# Altium project Version1.0.PrjPcb
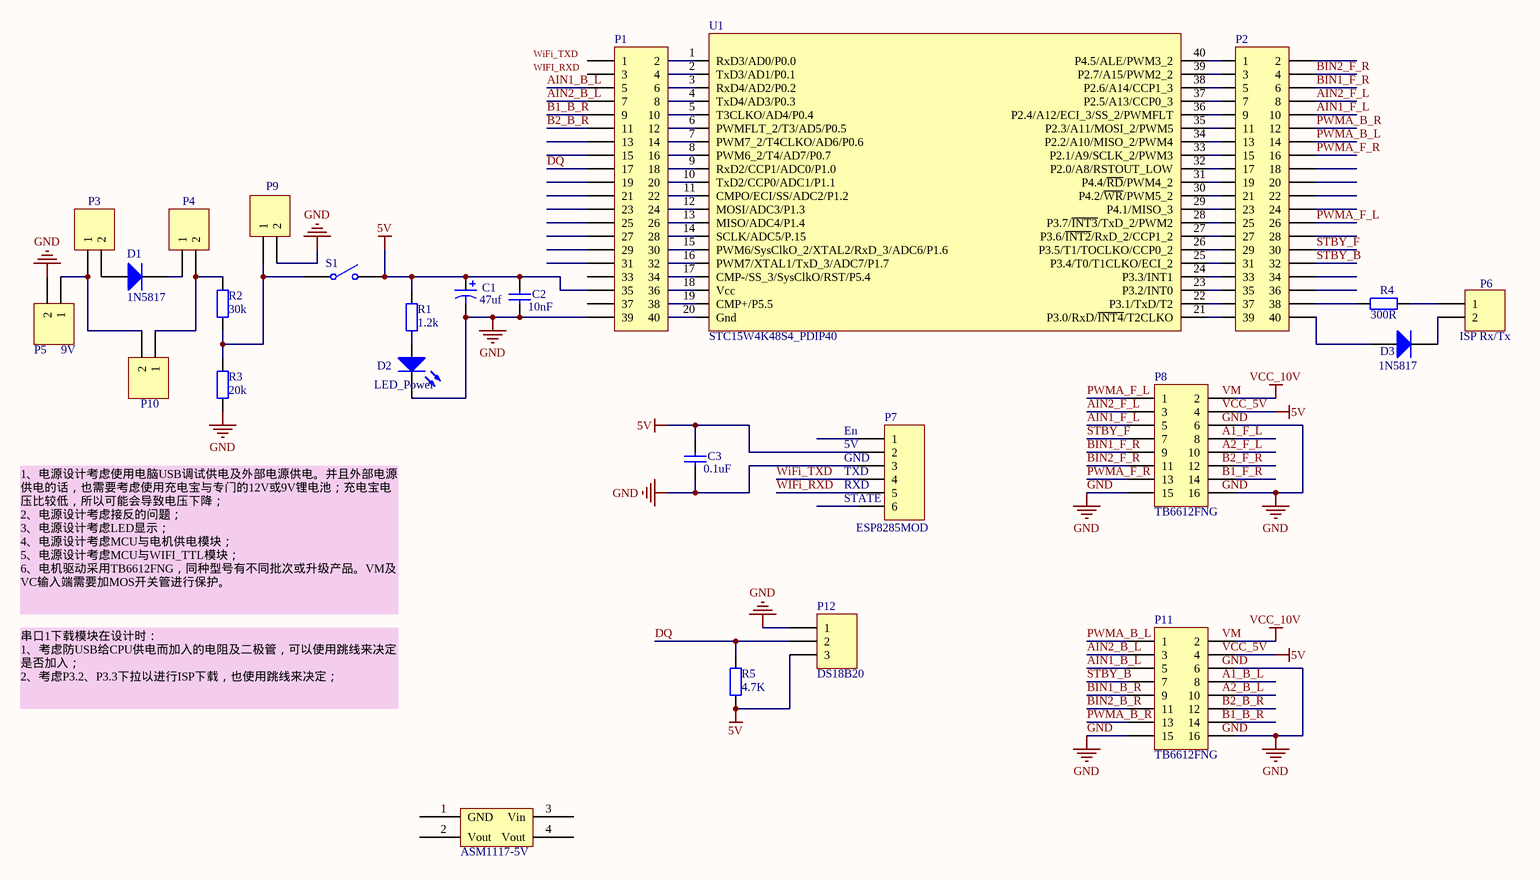
[diagram p0: Controller.SchDoc]
2 sheets, 105 parts. Net scope: global (net labels, ports and power ports of the same name join across sheets).
Sheets:
  Controller.SchDoc
  Controller2.SchDoc

## Sheet Controller.SchDoc
size A3

### Parts
(Parts that share a designator on the sheet are numbered #1, #2 ... from top to bottom, then left to right.)
ASM1117-5V#1  ASM1117-5V  [SOT-223]  (value not drawn)
C1#1  value 47uf  [RB7.6-15]  (hidden comment: Cap Pol1)
C2#1  value 10nF  [RAD-0.3]  (hidden comment: Cap)
C3#1  value 0.1uF  [RAD-0.3]  (hidden comment: Cap)
D1#1  1N5817  [DO-35]
D2#1  LED_Power  [LED-0]
D3  1N5817  [DO-35]
P1#1  Header 20X2  [HDR2X20]  (value not drawn)
P2#1  Header 20X2  [HDR2X20]  (value not drawn)
P3#1  Header 2  [HDR1X2]  (value not drawn)
P4#1  Header 2  [HDR1X2]  (value not drawn)
P5#1  9V  [HDR1X2]
P6#1  ISP Rx/Tx  [HDR1X2]
P7#1  ESP8285MOD  [HDR1X6]
P8#1  TB6612FNG  [HDR2X8]
P9  Header 2  [HDR1X2]  (value not drawn)
P10  Header 2  [HDR1X2]  (value not drawn)
P11  TB6612FNG  [HDR2X8]
P12  DS18B20  [HDR1X3]
R1  value 1.2k  [AXIAL-0.4]  (hidden comment: Res2)
R2#1  value 30k  [AXIAL-0.4]  (hidden comment: Res2)
R3#1  value 20k  [AXIAL-0.4]  (hidden comment: Res2)
R4#1  value 300R  [AXIAL-0.4]  (hidden comment: Res2)
R5#1  value 4.7K  [AXIAL-0.4]  (hidden comment: Res2)
S1#1  SW-SPST  [SPST-2]  (value not drawn)
U1  STC15W4K48S4_PDIP40  [STC15W4K48S4_DIP40]

### Nets
5V: C1#1.1 C2#1.2 C3#1.2 P1#1.35 P7#1.2 P8#1.4 P11.4 P12.3 R1.1 R5#1.2 S1#1.2(NO)
GND: C1#1.2 C2#1.1 C3#1.1 D2#1.2(K) P1#1.39 P5#1.2 P7#1.3 P8#1.6 P8#1.15 P8#1.16 P9.2 P11.6 P11.15 P11.16 P12.1 R3#1.1
VCC_10V: P8#1.2 P11.2
AIN1_B_L: P1#1.5 P11.5
AIN1_F_L: P2#1.10 P8#1.5
AIN2_B_L: P1#1.7 P11.3
AIN2_F_L: P2#1.8 P8#1.3
B1_B_R: P1#1.9
B2_B_R: P1#1.11
BIN1_B_R: P11.9
BIN1_F_R: P2#1.6 P8#1.9
BIN2_B_R: P11.11
BIN2_F_R: P2#1.4 P8#1.11
DQ: P1#1.17 P12.2 R5#1.1
PWMA_B_L: P2#1.14 P11.1
PWMA_B_R: P2#1.12 P11.13
PWMA_F_L: P2#1.26 P8#1.1
PWMA_F_R: P2#1.16 P8#1.13
STBY_B: P2#1.32 P11.7
STBY_F: P2#1.30 P8#1.7
WIFi_RXD: P7#1.5
WiFi_TXD: P7#1.4
NetD1#1_1: D1#1.1(A) P3#1.2
NetD1#1_2: D1#1.2(K) P4#1.1
NetD2#1_1: D2#1.1(A) R1.2
NetD3_1: D3.1(A) P2#1.40
NetD3_2: D3.2(K) P6#1.2
NetP1#1_2: P1#1.2 U1.1(RxD3/AD0/P0.0)
NetP1#1_4: P1#1.4 U1.2(TxD3/AD1/P0.1)
NetP1#1_6: P1#1.6 U1.3(RxD4/AD2/P0.2)
NetP1#1_8: P1#1.8 U1.4(TxD4/AD3/P0.3)
NetP1#1_10: P1#1.10 U1.5(T3CLKO/AD4/P0.4)
NetP1#1_12: P1#1.12 U1.6(PWMFLT_2/T3/AD5/P0.5)
NetP1#1_14: P1#1.14 U1.7(PWM7_2/T4CLKO/AD6/P0.6)
NetP1#1_16: P1#1.16 U1.8(PWM6_2/T4/AD7/P0.7)
NetP1#1_18: P1#1.18 U1.9(RxD2/CCP1/ADC0/P1.0)
NetP1#1_20: P1#1.20 U1.10(TxD2/CCP0/ADC1/P1.1)
NetP1#1_22: P1#1.22 U1.11(CMPO/ECI/SS/ADC2/P1.2)
NetP1#1_24: P1#1.24 U1.12(MOSI/ADC3/P1.3)
NetP1#1_26: P1#1.26 U1.13(MISO/ADC4/P1.4)
NetP1#1_28: P1#1.28 U1.14(SCLK/ADC5/P.15)
NetP1#1_30: P1#1.30 U1.15(PWM6/SysClkO_2/XTAL2/RxD_3/ADC6/P1.6)
NetP1#1_32: P1#1.32 U1.16(PWM7/XTAL1/TxD_3/ADC7/P1.7)
NetP1#1_34: P1#1.34 U1.17(CMP-/SS_3/SysClkO/RST/P5.4)
NetP1#1_36: P1#1.36 U1.18(Vcc)
NetP1#1_38: P1#1.38 U1.19(CMP+/P5.5)
NetP1#1_40: P1#1.40 U1.20(Gnd)
NetP2#1_1: P2#1.1 U1.40(P4.5/ALE/PWM3_2)
NetP2#1_3: P2#1.3 U1.39(P2.7/A15/PWM2_2)
NetP2#1_5: P2#1.5 U1.38(P2.6/A14/CCP1_3)
NetP2#1_7: P2#1.7 U1.37(P2.5/A13/CCP0_3)
NetP2#1_9: P2#1.9 U1.36(P2.4/A12/ECI_3/SS_2/PWMFLT)
NetP2#1_11: P2#1.11 U1.35(P2.3/A11/MOSI_2/PWM5)
NetP2#1_13: P2#1.13 U1.34(P2.2/A10/MISO_2/PWM4)
NetP2#1_15: P2#1.15 U1.33(P2.1/A9/SCLK_2/PWM3)
NetP2#1_17: P2#1.17 U1.32(P2.0/A8/RSTOUT_LOW)
NetP2#1_19: P2#1.19 U1.31(P4.4/~{RD}/PWM4_2)
NetP2#1_21: P2#1.21 U1.30(P4.2/~{WR}/PWM5_2)
NetP2#1_23: P2#1.23 U1.29(P4.1/MISO_3)
NetP2#1_25: P2#1.25 U1.28(P3.7/~{INT3}/TxD_2/PWM2)
NetP2#1_27: P2#1.27 U1.27(P3.6/~{INT2}/RxD_2/CCP1_2)
NetP2#1_29: P2#1.29 U1.26(P3.5/T1/TOCLKO/CCP0_2)
NetP2#1_31: P2#1.31 U1.25(P3.4/T0/T1CLKO/ECI_2)
NetP2#1_33: P2#1.33 U1.24(P3.3/INT1)
NetP2#1_35: P2#1.35 U1.23(P3.2/INT0)
NetP2#1_37: P2#1.37 U1.22(P3.1/TxD/T2)
NetP2#1_38: P2#1.38 R4#1.1
NetP2#1_39: P2#1.39 U1.21(P3.0/RxD/~{INT4}/T2CLKO)
NetP3#1_1: P3#1.1 P5#1.1 P10.2
NetP4#1_2: P4#1.2 P10.1 R2#1.2
NetP6#1_1: P6#1.1 R4#1.2
NetP9_1: P9.1 R2#1.1 R3#1.2 S1#1.1(COMMON)

Not connected (* = marked no-connect by the designer): ASM1117-5V#1 1(GND) 2(Vout) 3(Vin) 4(Vout); P1#1 1 3 13 15 19 21 23 25 27 29 31 33 37; P2#1 2 18 20 22 24 28 34 36; P7#1 1 6; P8#1 8 10 12 14; P11 8 10 12 14

### Notes on the sheet
- (near P7#1) En
- (near P7#1) 5V
- (near P7#1) GND
- (near P7#1) TXD
- (near P7#1) RXD
- (near P7#1) STATE
- 1、电源设计考虑使用电脑USB调试供电及外部电源供电。并且外部电源供电的话，也需要考虑使用充电宝与专门的12V或9V锂电池；充电宝电压比较低，所以可能会导致电压下降；
  2、电源设计考虑接反的问题；
  3、电源设计考虑LED显示；
  4、电源设计考虑MCU与电机供电模块；
  5、电源设计考虑MCU与WIFI_TTL模块；
  6、电机驱动采用TB6612FNG，同种型号有不同批次或升级产品。VM及VC输入端需要加MOS开关管进行保护。
- 串口1下载模块在设计时：
  1、考虑防USB给CPU供电而加入的电阻及二极管，可以使用跳线来决定是否加入；
  2、考虑P3.2、P3.3下拉以进行ISP下载，也使用跳线来决定；
- Labels drawn without touching a wire or pin: A1_B_L, A1_F_L, A2_B_L, A2_F_L, B1_B_R, B1_F_R, B2_B_R, B2_F_R, GND, VCC_5V, VM, WIFI_RXD, WiFi_TXD

### Library data of the parts
C1#1 = Cap Pol1: Polarized Capacitor (Radial); Published: 8-Jun-2000; LatestRevisionDate: 17-Jul-2002; LatestRevisionNote: Re-released for DXP Platform.; PackageReference: RB7.6-15; Publisher: Altium Limited; PackageDescription: Polarized Capacitor (Radial); 2 Leads
C2#1 C3#1 = Cap: Capacitor; Published: 8-Jun-2000; LatestRevisionDate: 17-Jul-2002; LatestRevisionNote: Re-released for DXP Platform.; PackageReference: RAD-0.3; Publisher: Altium Limited; PackageDescription: Radial Cap, Thru-Hole; 2 Leads; 0.3 in Pin Spacing
D1#1 D3 = Diode 1N914: High Conductance Fast Diode; Published: 8-Jun-2000; LatestRevisionDate: 17-Jul-2002; LatestRevisionNote: Re-released for DXP Platform.; DatasheetVersion: 1997; PackageReference: DO-35; Publisher: Altium Limited; PackageDescription: Diode, Axial; Body 3.8 x 1.9 mm (LxDia. max), Lead Dia. 0.53 mm (max); Code_JEDEC: DO-204-AH; ComponentLink1Description: Manufacturer Link; ComponentLink1URL: http://www.fairchildsemi.com/; ComponentLink2Description: Datasheet; ComponentLink2URL: http://www.fairchildsemi.com/ds/1N%2F1N4448.pdf
D2#1 = LED0: Typical INFRARED GaAs LED; Published: 8-Jun-2000; LatestRevisionDate: 08-Jul-2005; LatestRevisionNote: Mech Layer 1 removed.; PackageReference: LED-0; Publisher: Altium Limited; PackageDescription: LED; 2 Leads
P1#1 P2#1 = Header 20X2: Header, 20-Pin, Dual row; LatestRevisionDate: 17-Jul-2002; LatestRevisionNote: Re-released for DXP Platform.; Publisher: Altium Limited
P3#1 P4#1 P5#1 P6#1 P9 P10 = Header 2: Header, 2-Pin; LatestRevisionDate: 17-Jul-2002; LatestRevisionNote: Re-released for DXP Platform.; Publisher: Altium Limited
P7#1 = Header 6: Header, 6-Pin; LatestRevisionDate: 17-Jul-2002; LatestRevisionNote: Re-released for DXP Platform.; Publisher: Altium Limited
P8#1 P11 = Header 8X2: Header, 8-Pin, Dual row; LatestRevisionDate: 17-Jul-2002; LatestRevisionNote: Re-released for DXP Platform.; Publisher: Altium Limited
P12 = Header 3: Header, 3-Pin; LatestRevisionDate: 17-Jul-2002; LatestRevisionNote: Re-released for DXP Platform.; Publisher: Altium Limited
R1 R2#1 R3#1 R4#1 R5#1 = Res2: Resistor; Published: 8-Jun-2000; LatestRevisionDate: 17-Jul-2002; LatestRevisionNote: Re-released for DXP Platform.; PackageReference: AXIAL-0.4; Publisher: Altium Limited; PackageDescription: Axial Device, Thru-Hole; 2 Leads; 0.4 in Pin Spacing
S1#1 = SW-SPST: Single-Pole, Single-Throw Switch; Published: 24-Mar-1999; LatestRevisionDate: 17-Jul-2002; LatestRevisionNote: Re-released for DXP Platform.; PackageReference: SPST-2; Publisher: Altium Limited; PackageDescription: Switch; 2 Leads
U1 = STC15W4K48S4_PDIP40: STC15W4K48S4

## Sheet Controller2.SchDoc
size A3
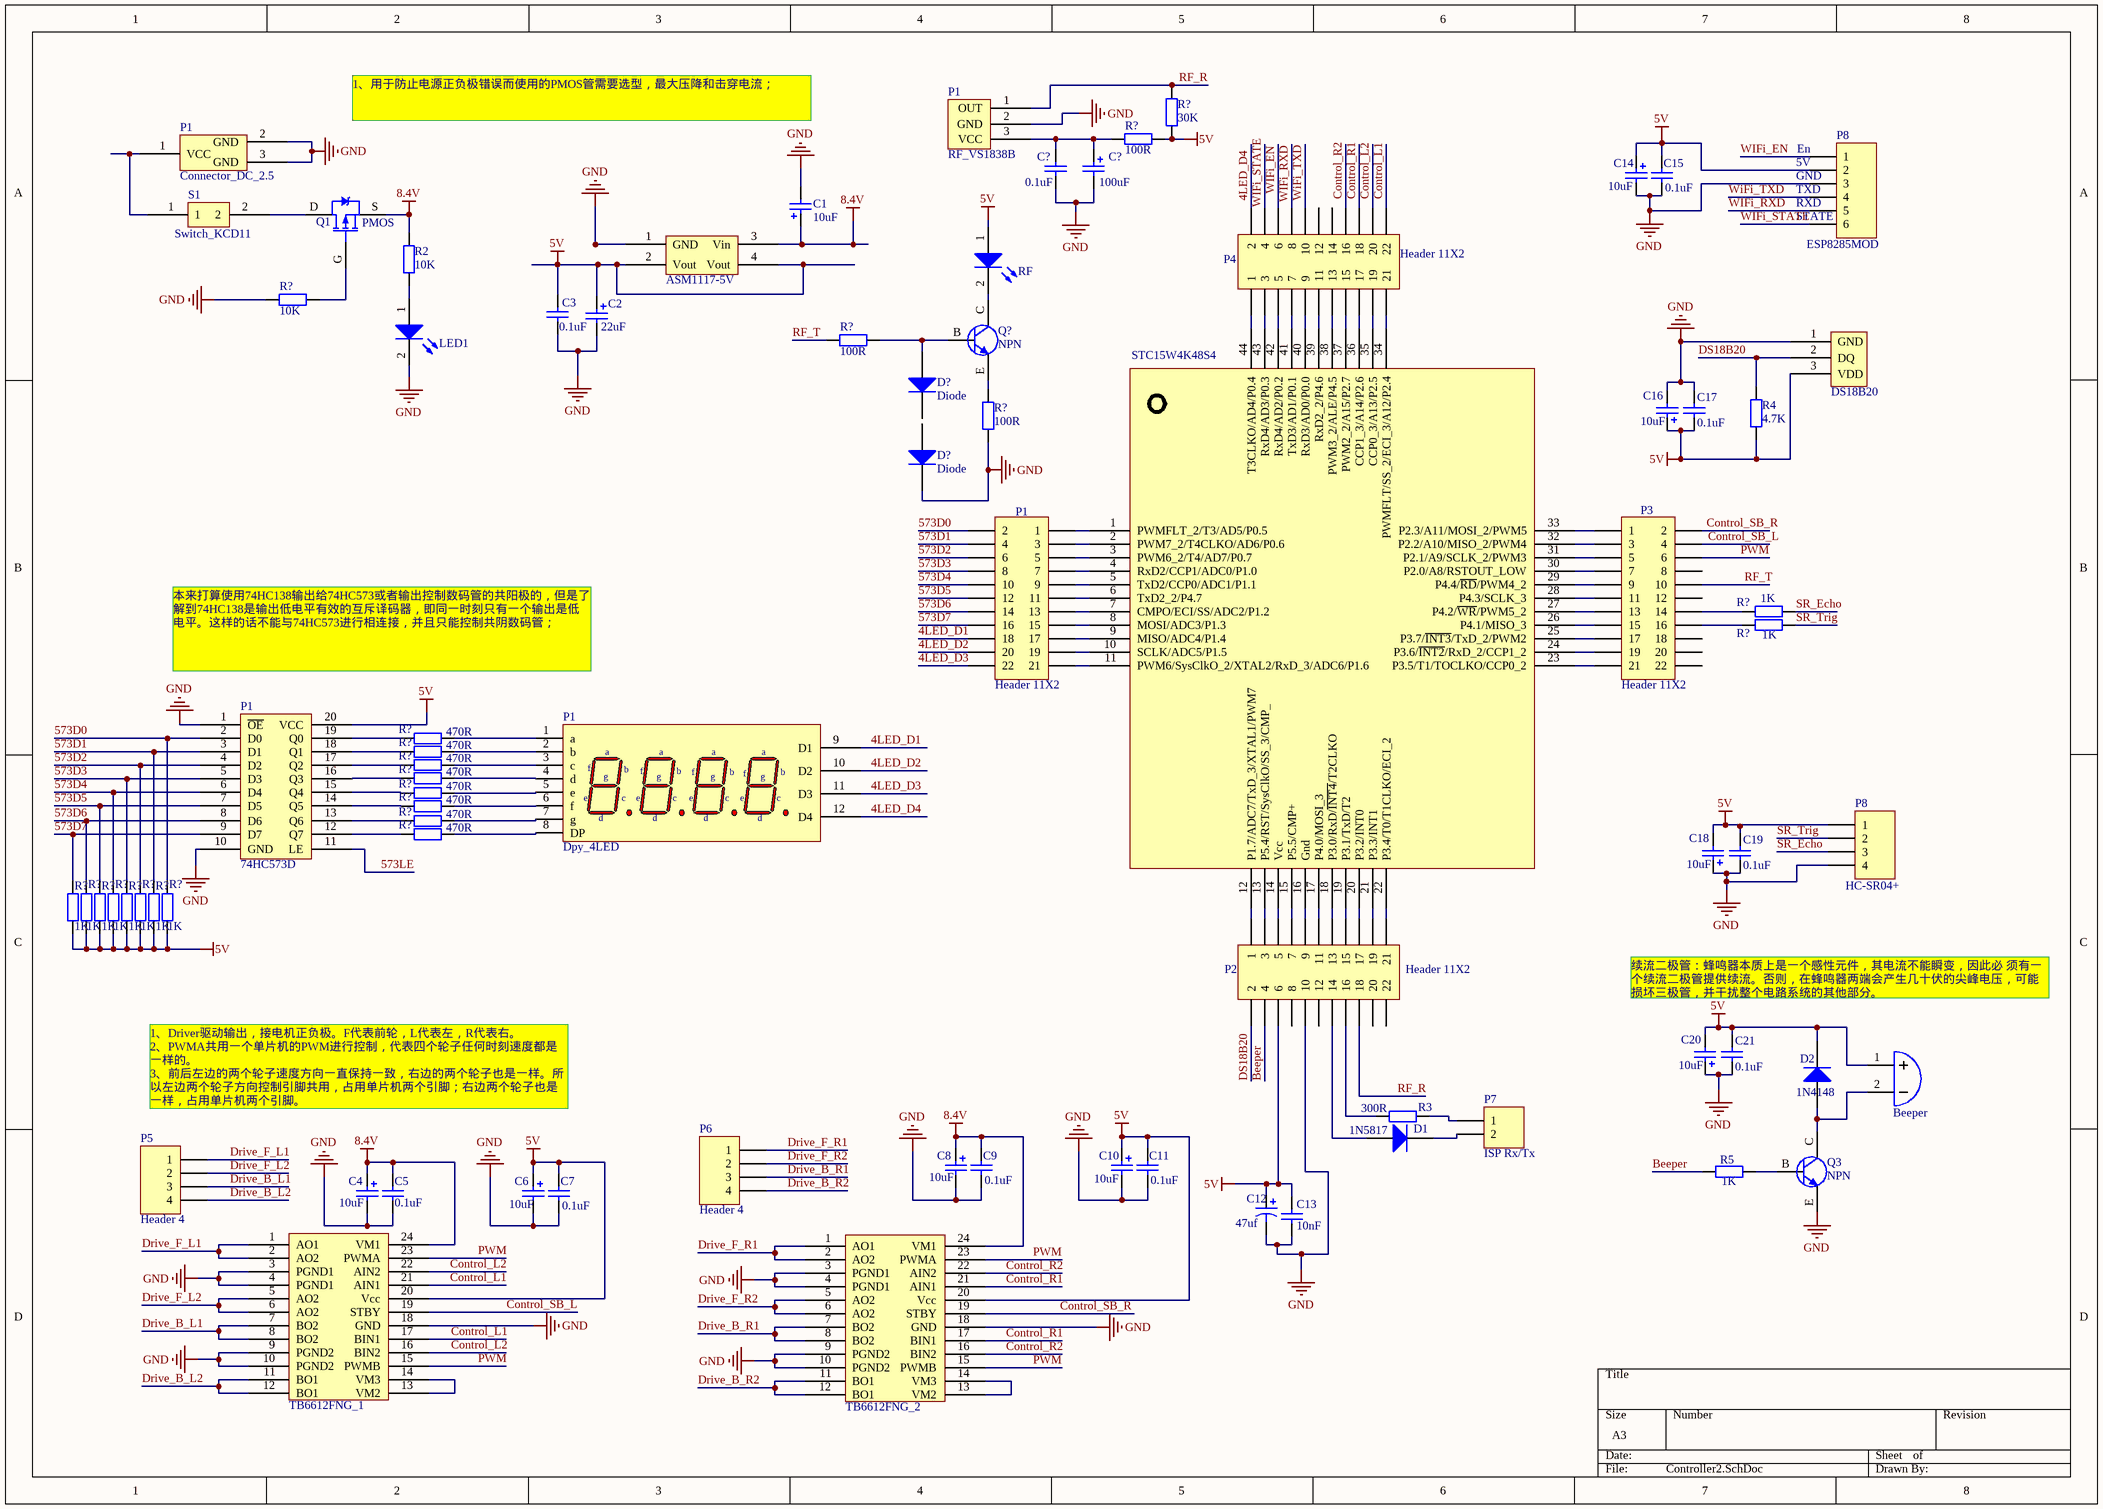
[diagram p1: Controller2.SchDoc]

### Parts
(Parts that share a designator on the sheet are numbered #1, #2 ... from top to bottom, then left to right.)
*  STC15W4K48S4  [STC15W4K48S4_LQFP44]
ASM1117-5V#2  ASM1117-5V  [SOT-223]  (value not drawn)
Beeper  Beeper  [Buzzer-2Pins]  (value not drawn)
C1#2  value 10uF  [C1206-Pole]  (hidden comment: Cap_Pole)
C2#2  value 22uF  [C1206-Pole]  (hidden comment: Cap_Pole)
C3#2  value 0.1uF  [C0603]  (hidden comment: Cap)
C4  10uF  [C1206-Pole]
C5  0.1uF  [C0603]
C6  10uF  [C1206-Pole]
C7  0.1uF  [C0603]
C8  10uF  [C1206-Pole]
C9  0.1uF  [C0603]
C10  10uF  [C1206-Pole]
C11  0.1uF  [C0603]
C12  value 47uf  [RB7.6-15]  (hidden comment: Cap Pol1)
C13  value 10nF  [RAD-0.3]  (hidden comment: Cap)
C14  10uF  [C1206-Pole]
C15  0.1uF  [C0603]
C16  10uF  [C1206-Pole]
C17  0.1uF  [C0603]
C18  10uF  [C1206-Pole]
C19  0.1uF  [C0603]
C20  10uF  [C1206-Pole]
C21  0.1uF  [C0603]
C?#1  value 0.1uF  [C0603]  (hidden comment: Cap)
C?#2  value 100uF  [C1206-Pole]  (hidden comment: Cap_Pole)
D1#2  1N5817  [DO-35]
D2#2  1N4148  [SMA/DO-214AC]
D?#1  Diode  [SMA/DO-214AC]
D?#2  Diode  [SMA/DO-214AC]
DS18B20  DS18B20  [TO-92]  (value not drawn)
LED1  LED-0805  [LED-0805]  (value not drawn)
P1#2  RF_VS1838B  [RF_VS1838B]
P1#3  Connector_DC_2.5  [Connector_DC_2.5]
P1#4  Header 11X2  [HDR2X11]
P1#5  74HC573D  [74HC573D_SOP]
P1#6  Dpy_4LED  [Dpy_LED4_Power]
P2#2  Header 11X2  [HDR2X11]
P3#2  Header 11X2  [HDR2X11]
P4#2  Header 11X2  [HDR2X11]
P5#2  Header 4  [HDR1X4]
P6#2  Header 4  [HDR1X4]
P7#2  ISP Rx/Tx  [HDR1X2]
P8#2  ESP8285MOD  [HDR1X6]
P8#3  HC-SR04+  [HDR1X4]
Q1  PMOS  [SOT-23/MOS]
Q3  NPN  [SOT-23/transistor]
Q?  NPN  [SOT-23/transistor]
R2#2  10K  [R0603]
R3#2  value 300R  [AXIAL-0.4]  (hidden comment: Res2)
R4#2  4.7K  [R0603]
R5#2  1K  [R0603]
R?#1  100R  [R0603]
R?#2  30K  [R0603]
R?#3  10K  [R0603]
R?#4  100R  [R0603]
R?#5  100R  [R0603]
R?#6  1K  [R0603]
R?#7  1K  [R0603]
R?#8  470R  [R0603]
R?#9  470R  [R0603]
R?#10  470R  [R0603]
R?#11  470R  [R0603]
R?#12  470R  [R0603]
R?#13  470R  [R0603]
R?#14  470R  [R0603]
R?#15  470R  [R0603]
R?#16  1K  [R0603]
R?#17  1K  [R0603]
R?#18  1K  [R0603]
R?#19  1K  [R0603]
R?#20  1K  [R0603]
R?#21  1K  [R0603]
R?#22  1K  [R0603]
R?#23  1K  [R0603]
RF  LED-0805  [LED-0805]  (value not drawn)
S1#2  Switch_KCD11  [Switch_KCD11]
TB6612FNG_1  TB6612FNG  [ssop24]  (value not drawn)
TB6612FNG_2  TB6612FNG  [ssop24]  (value not drawn)

### Nets
5V: ASM1117-5V#2.2(Vout) ASM1117-5V#2.4(Vout) Beeper.1(A) C2#2.1 C3#2.1 C6.1 C7.1 C10.1 C11.1 C12.1 C13.2 C16.1 C17.2 C18.2 C19.1 C20.2 C21.1 D2#2.2 DS18B20.3(VDD) P1#5.20(VCC) P2#2.6 P8#3.1 R4#2.1 R?#1.1 R?#2.2 R?#16.1 R?#17.1 R?#18.1 R?#19.1 R?#20.1 R?#21.1 R?#22.1 R?#23.1 RF.1(A) TB6612FNG_1.20(Vcc) TB6612FNG_2.20(Vcc)
8.4V: ASM1117-5V#2.3(Vin) C1#2.1 C4.1 C5.1 C8.1 C9.1 Q1.S R2#2.1 TB6612FNG_1.24(VM1) TB6612FNG_2.24(VM1)
GND: ASM1117-5V#2.1(GND) C1#2.2 C2#2.2 C3#2.2 C4.2 C5.2 C6.2 C7.2 C8.2 C9.2 C10.2 C11.2 C12.2 C13.1 C14.2 C15.2 C16.2 C17.1 C18.1 C19.2 C20.1 C21.2 C?#1.2 C?#2.2 D?#2.2 DS18B20.1(GND) LED1.2(K) P1#2.2(GND) P1#3.2(GND) P1#3.3(GND) P1#5.1(~{OE}) P1#5.10(GND) P2#2.10 P8#2.3 P8#3.4 Q3.E R?#3.1 R?#5.2 TB6612FNG_1.3(PGND1) TB6612FNG_1.4(PGND1) TB6612FNG_1.9(PGND2) TB6612FNG_1.10(PGND2) TB6612FNG_1.18(GND) TB6612FNG_2.3(PGND1) TB6612FNG_2.4(PGND1) TB6612FNG_2.9(PGND2) TB6612FNG_2.10(PGND2) TB6612FNG_2.18(GND)
4LED_D1: P1#4.18 P1#6.9(D1)
4LED_D2: P1#4.20 P1#6.10(D2)
4LED_D3: P1#4.22 P1#6.11(D3)
4LED_D4: P1#6.12(D4) P4#2.2
573D0: P1#4.2 P1#5.2(D0) R?#23.2
573D1: P1#4.4 P1#5.3(D1) R?#22.2
573D2: P1#4.6 P1#5.4(D2) R?#21.2
573D3: P1#4.8 P1#5.5(D3) R?#20.2
573D4: P1#4.10 P1#5.6(D4) R?#19.2
573D5: P1#4.12 P1#5.7(D5) R?#18.2
573D6: P1#4.14 P1#5.8(D6) R?#17.2
573D7: P1#4.16 P1#5.9(D7) R?#16.2
573LE: P1#5.11(LE)
Beeper: P2#2.4 R5#2.1
Control_L1: P4#2.22 TB6612FNG_1.17(BIN1) TB6612FNG_1.21(AIN1)
Control_L2: P4#2.20 TB6612FNG_1.16(BIN2) TB6612FNG_1.22(AIN2)
Control_R1: P4#2.18 TB6612FNG_2.17(BIN1) TB6612FNG_2.21(AIN1)
Control_R2: P4#2.16 TB6612FNG_2.16(BIN2) TB6612FNG_2.22(AIN2)
Control_SB_L: P3#2.4 TB6612FNG_1.19(STBY)
Control_SB_R: P3#2.2 TB6612FNG_2.19(STBY)
Drive_B_L1: P5#2.3 TB6612FNG_1.7(BO2) TB6612FNG_1.8(BO2)
Drive_B_L2: P5#2.4 TB6612FNG_1.11(BO1) TB6612FNG_1.12(BO1)
Drive_B_R1: P6#2.3 TB6612FNG_2.7(BO2) TB6612FNG_2.8(BO2)
Drive_B_R2: P6#2.4 TB6612FNG_2.11(BO1) TB6612FNG_2.12(BO1)
Drive_F_L1: P5#2.1 TB6612FNG_1.1(AO1) TB6612FNG_1.2(AO2)
Drive_F_L2: P5#2.2 TB6612FNG_1.5(AO2) TB6612FNG_1.6(AO2)
Drive_F_R1: P6#2.1 TB6612FNG_2.1(AO1) TB6612FNG_2.2(AO2)
Drive_F_R2: P6#2.2 TB6612FNG_2.5(AO2) TB6612FNG_2.6(AO2)
DS18B20: DS18B20.2(DQ) P2#2.2 R4#2.2
PWM: P3#2.6 TB6612FNG_1.15(PWMB) TB6612FNG_1.23(PWMA) TB6612FNG_2.15(PWMB) TB6612FNG_2.23(PWMA)
RF_R: P1#2.1(OUT) P2#2.18 R?#2.1
RF_T: P3#2.10 R?#4.2
SR_Echo: P8#3.3 R?#6.2
SR_Trig: P8#3.2 R?#7.2
WIFi_EN: P4#2.6 P8#2.1
WIFi_RXD: P4#2.8 P8#2.5
WIFi_STATE: P4#2.4 P8#2.6
WiFi_TXD: P4#2.10 P8#2.4
Net*_1: *.1(PWMFLT_2/T3/AD5/P0.5) P1#4.1
Net*_2: *.2(PWM7_2/T4CLKO/AD6/P0.6) P1#4.3
Net*_3: *.3(PWM6_2/T4/AD7/P0.7) P1#4.5
Net*_4: *.4(RxD2/CCP1/ADC0/P1.0) P1#4.7
Net*_5: *.5(TxD2/CCP0/ADC1/P1.1) P1#4.9
Net*_6: *.6(TxD2_2/P4.7) P1#4.11
Net*_7: *.7(CMPO/ECI/SS/ADC2/P1.2) P1#4.13
Net*_8: *.8(MOSI/ADC3/P1.3) P1#4.15
Net*_9: *.9(MISO/ADC4/P1.4) P1#4.17
Net*_10: *.10(SCLK/ADC5/P1.5) P1#4.19
Net*_11: *.11(PWM6/SysClkO_2/XTAL2/RxD_3/ADC6/P1.6) P1#4.21
Net*_12: *.12(P1.7/ADC7/TxD_3/XTAL1/PWM7) P2#2.1
Net*_13: *.13(P5.4/RST/SysClkO/SS_3/CMP_) P2#2.3
Net*_14: *.14(Vcc) P2#2.5
Net*_15: *.15(P5.5/CMP+) P2#2.7
Net*_16: *.16(Gnd) P2#2.9
Net*_17: *.17(P4.0/MOSI_3) P2#2.11
Net*_18: *.18(P3.0/RxD/~{INT4}/T2CLKO) P2#2.13
Net*_19: *.19(P3.1/TxD/T2) P2#2.15
Net*_20: *.20(P3.2/INT0) P2#2.17
Net*_21: *.21(P3.3/INT1) P2#2.19
Net*_22: *.22(P3.4/T0/T1CLKO/ECI_2) P2#2.21
Net*_23: *.23(P3.5/T1/TOCLKO/CCP0_2) P3#2.21
Net*_24: *.24(P3.6/~{INT2}/RxD_2/CCP1_2) P3#2.19
Net*_25: *.25(P3.7/~{INT3}/TxD_2/PWM2) P3#2.17
Net*_26: *.26(P4.1/MISO_3) P3#2.15
Net*_27: *.27(P4.2/~{WR}/PWM5_2) P3#2.13
Net*_28: *.28(P4.3/SCLK_3) P3#2.11
Net*_29: *.29(P4.4/~{RD}/PWM4_2) P3#2.9
Net*_30: *.30(P2.0/A8/RSTOUT_LOW) P3#2.7
Net*_31: *.31(P2.1/A9/SCLK_2/PWM3) P3#2.5
Net*_32: *.32(P2.2/A10/MISO_2/PWM4) P3#2.3
Net*_33: *.33(P2.3/A11/MOSI_2/PWM5) P3#2.1
Net*_34: *.34(PWMFLT/SS_2/ECI_3/A12/P2.4) P4#2.21
Net*_35: *.35(CCP0_3/A13/P2.5) P4#2.19
Net*_36: *.36(CCP1_3/A14/P2.6) P4#2.17
Net*_37: *.37(PWM2_2/A15/P2.7) P4#2.15
Net*_38: *.38(PWM3_2/ALE/P4.5) P4#2.13
Net*_39: *.39(RxD2_2/P4.6) P4#2.11
Net*_40: *.40(RxD3/AD0/P0.0) P4#2.9
Net*_41: *.41(TxD3/AD1/P0.1) P4#2.7
Net*_42: *.42(RxD4/AD2/P0.2) P4#2.5
Net*_43: *.43(RxD4/AD3/P0.3) P4#2.3
Net*_44: *.44(T3CLKO/AD4/P0.4) P4#2.1
NetBeeper_2: Beeper.2(B) D2#2.1 Q3.C
NetC14_1: C14.1 C15.1 P8#2.2
NetC?#1_1: C?#1.1 C?#2.1 P1#2.3(VCC) R?#1.2
NetD1#2_1: D1#2.1(A) P2#2.14
NetD1#2_2: D1#2.2(K) P7#2.2
NetD?#1_1: D?#1.1 Q?.B R?#4.1
NetLED1_1: LED1.1(A) R2#2.2
NetP1#3_1: P1#3.1(VCC) S1#2.1
NetP1#5_12: P1#5.12(Q7) R?#15.1
NetP1#5_13: P1#5.13(Q6) R?#14.1
NetP1#5_14: P1#5.14(Q5) R?#13.1
NetP1#5_15: P1#5.15(Q4) R?#12.1
NetP1#5_16: P1#5.16(Q3) R?#11.1
NetP1#5_17: P1#5.17(Q2) R?#10.1
NetP1#5_18: P1#5.18(Q1) R?#9.1
NetP1#5_19: P1#5.19(Q0) R?#8.1
NetP1#6_1: P1#6.1(a) R?#8.2
NetP1#6_2: P1#6.2(b) R?#9.2
NetP1#6_3: P1#6.3(c) R?#10.2
NetP1#6_4: P1#6.4(d) R?#11.2
NetP1#6_5: P1#6.5(e) R?#12.2
NetP1#6_6: P1#6.6(f) R?#13.2
NetP1#6_7: P1#6.7(g) R?#14.2
NetP1#6_8: P1#6.8(DP) R?#15.2
NetP2#2_16: P2#2.16 R3#2.1
NetP3#2_14: P3#2.14 R?#6.1
NetP3#2_16: P3#2.16 R?#7.1
NetP7#2_1: P7#2.1 R3#2.2
NetQ1_D: Q1.D S1#2.2
NetQ1_G: Q1.G R?#3.2
NetQ3_B: Q3.B R5#2.2
NetQ?_C: Q?.C RF.2(K)
NetQ?_E: Q?.E R?#5.1
NetTB6612FNG_1_13: TB6612FNG_1.13(VM2) TB6612FNG_1.14(VM3)
NetTB6612FNG_2_13: TB6612FNG_2.13(VM2) TB6612FNG_2.14(VM3)

Not connected (* = marked no-connect by the designer): D?#1 2; D?#2 1; P2#2 8 12 20 22; P3#2 8 12 18 20 22; P4#2 12 14

### Notes on the sheet
- 1、用于防止电源正负极错误而使用的PMOS管需要选型，最大压降和击穿电流；
- (near P8#2) 5V
- (near P8#2) GND
- (near P8#2) En
- (near P8#2) TXD
- (near P8#2) RXD
- (near P8#2) STATE
- 本来打算使用74HC138输出给74HC573或者输出控制数码管的共阳极的，但是了解到74HC138是输出低电平有效的互斥译码器，即同一时刻只有一个输出是低电平。这样的话不能与74HC573进行相连接，并且只能控制共阴数码管；
- 续流二极管：蜂鸣器本质上是一个感性元件，其电流不能瞬变，因此必 须有一个续流二极管提供续流。否则，在蜂鸣器两端会产生几十伏的尖峰电压，可能损坏三极管，并干扰整个电路系统的其他部分。
- 1、Driver驱动输出，接电机正负极。F代表前轮，L代表左，R代表右。
  2、PWMA共用一个单片机的PWM进行控制，代表四个轮子任何时刻速度都是一样的。
  3、前后左边的两个轮子速度方向一直保持一致，右边的两个轮子也是一样。所以左边两个轮子方向控制引脚共用，占用单片机两个引脚；右边两个轮子也是一样，占用单片机两个引脚。
- Labels drawn without touching a wire or pin: 5V

### Library data of the parts
* = STC15W4K48S4_LQFP44
C1#2 C2#2 C4 C6 C8 C10 C14 C16 C18 C20 C?#2 = Cap_Pole: cap with pole
  C4 C6 C8 C10 C14 C16 C18 C20: value: 10uF
C3#2 C5 C7 C9 C11 C15 C17 C19 C21 C?#1 = Cap: cap without pole
C12 = Cap Pol1: Polarized Capacitor (Radial); Published: 8-Jun-2000; LatestRevisionDate: 17-Jul-2002; LatestRevisionNote: Re-released for DXP Platform.; PackageReference: RB7.6-15; Publisher: Altium Limited; PackageDescription: Polarized Capacitor (Radial); 2 Leads
C13 = Cap: Capacitor; Published: 8-Jun-2000; LatestRevisionDate: 17-Jul-2002; LatestRevisionNote: Re-released for DXP Platform.; PackageReference: RAD-0.3; Publisher: Altium Limited; PackageDescription: Radial Cap, Thru-Hole; 2 Leads; 0.3 in Pin Spacing
D1#2 = Diode 1N914: High Conductance Fast Diode; Published: 8-Jun-2000; LatestRevisionDate: 17-Jul-2002; LatestRevisionNote: Re-released for DXP Platform.; DatasheetVersion: 1997; PackageReference: DO-35; Publisher: Altium Limited; PackageDescription: Diode, Axial; Body 3.8 x 1.9 mm (LxDia. max), Lead Dia. 0.53 mm (max); Code_JEDEC: DO-204-AH; ComponentLink1Description: Manufacturer Link; ComponentLink1URL: http://www.fairchildsemi.com/; ComponentLink2Description: Datasheet; ComponentLink2URL: http://www.fairchildsemi.com/ds/1N%2F1N4448.pdf
D2#2 = Diode
LED1 RF = LED
P1#4 P2#2 P3#2 P4#2 = Header 11X2: Header, 11-Pin, Dual row; LatestRevisionDate: 17-Jul-2002; LatestRevisionNote: Re-released for DXP Platform.; Publisher: Altium Limited
P5#2 P6#2 P8#3 = Header 4: Header, 4-Pin; LatestRevisionDate: 17-Jul-2002; LatestRevisionNote: Re-released for DXP Platform.; Publisher: Altium Limited
P7#2 = Header 2: Header, 2-Pin; LatestRevisionDate: 17-Jul-2002; LatestRevisionNote: Re-released for DXP Platform.; Publisher: Altium Limited
P8#2 = Header 6: Header, 6-Pin; LatestRevisionDate: 17-Jul-2002; LatestRevisionNote: Re-released for DXP Platform.; Publisher: Altium Limited
R2#2 R4#2 R5#2 R?#1-R?#23 = Res: Resister
R3#2 = Res2: Resistor; Published: 8-Jun-2000; LatestRevisionDate: 17-Jul-2002; LatestRevisionNote: Re-released for DXP Platform.; PackageReference: AXIAL-0.4; Publisher: Altium Limited; PackageDescription: Axial Device, Thru-Hole; 2 Leads; 0.4 in Pin Spacing

## Nets that join several sheets
5V: Controller (11 pins), Controller2 (36 pins)
GND: Controller (16 pins), Controller2 (48 pins)
WIFi_RXD: Controller (P7#1.5), Controller2 (P4#2.8 P8#2.5)
WiFi_TXD: Controller (P7#1.4), Controller2 (P4#2.10 P8#2.4)